# Altium schematic sheet driver4-8.SchDoc
size A4; SheetNumber: 4; SheetTotal: 4
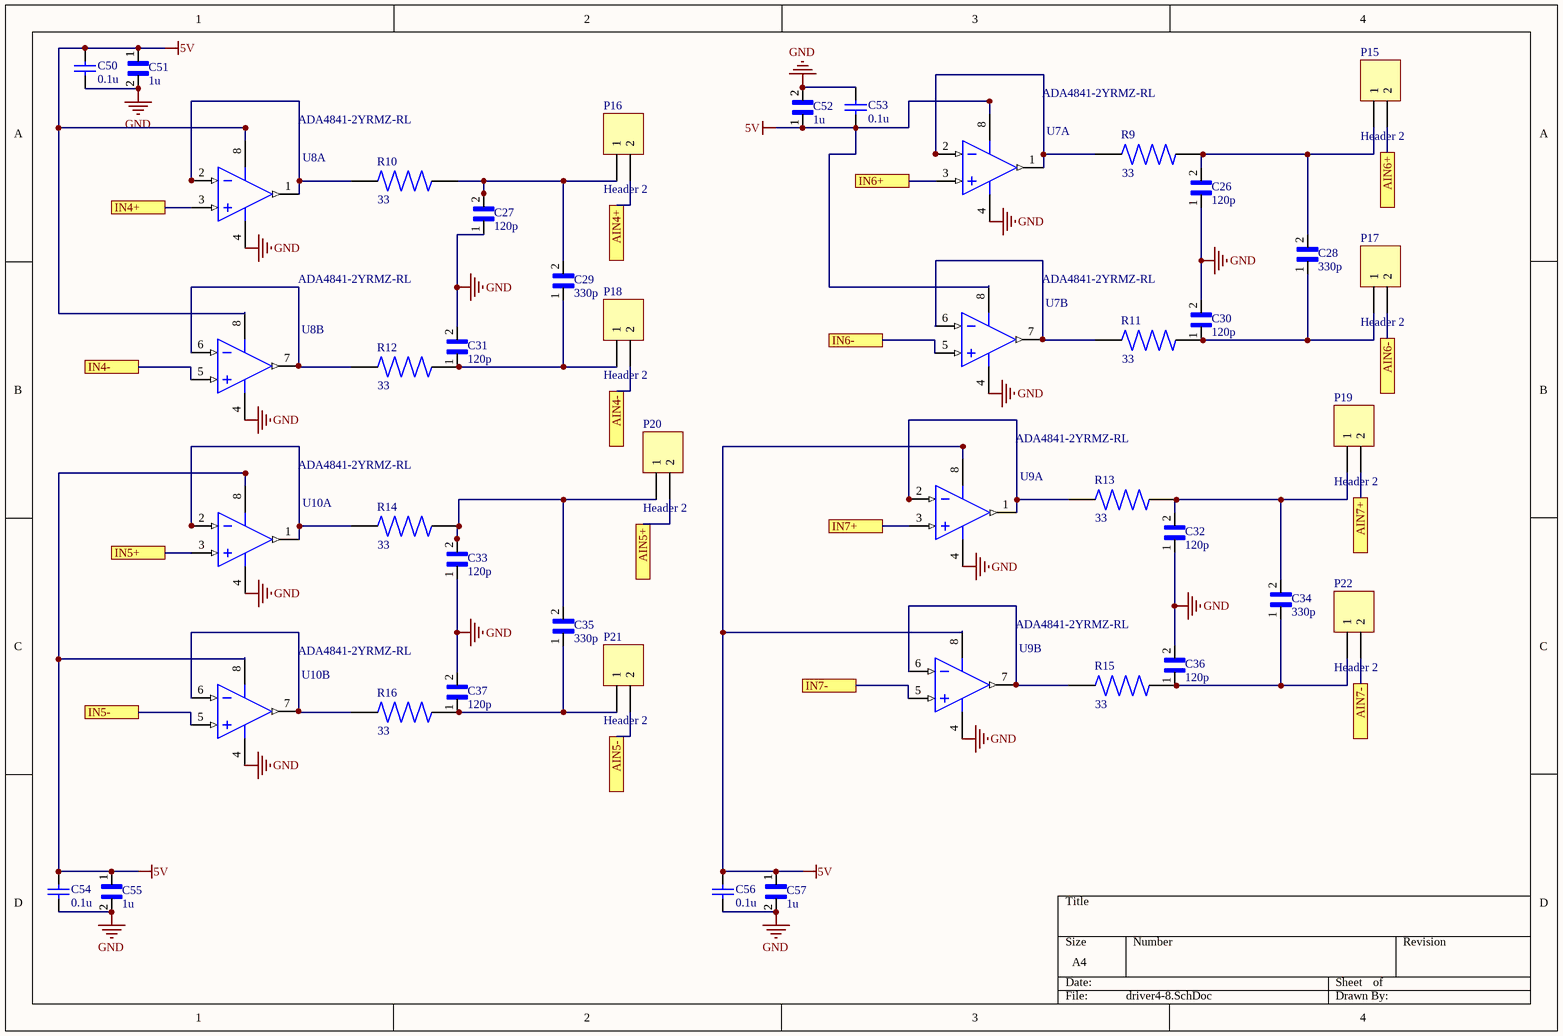
[diagram p0: driver4-8.SchDoc]

## Parts
C26  120p  [CAPC3216X94N]
C27  120p  [CAPC3216X94N]
C28  330p  [CAPC3216X94N]
C29  330p  [CAPC3216X94N]
C30  120p  [CAPC3216X94N]
C31  120p  [CAPC3216X94N]
C32  120p  [CAPC3216X94N]
C33  120p  [CAPC3216X94N]
C34  330p  [CAPC3216X94N]
C35  330p  [CAPC3216X94N]
C36  120p  [CAPC3216X94N]
C37  120p  [CAPC3216X94N]
C50  0.1u  [CAPC3216X94X50ML20T25]
C51  1u  [CAPC3216X127N]
C52  1u  [CAPC3216X127N]
C53  0.1u  [CAPC3216X94X50ML20T25]
C54  0.1u  [CAPC3216X94X50ML20T25]
C55  1u  [CAPC3216X127N]
C56  0.1u  [CAPC3216X94X50ML20T25]
C57  1u  [CAPC3216X127N]
P15  Header 2  [HDR1X2]
P16  Header 2  [HDR1X2]
P17  Header 2  [HDR1X2]
P18  Header 2  [HDR1X2]
P19  Header 2  [HDR1X2]
P20  Header 2  [HDR1X2]
P21  Header 2  [HDR1X2]
P22  Header 2  [HDR1X2]
R9  33  [RESC3116X75N]
R10  33  [RESC3116X75N]
R11  33  [RESC3116X75N]
R12  33  [RESC3116X75N]
R13  33  [RESC3116X75N]
R14  33  [RESC3116X75N]
R15  33  [RESC3116X75N]
R16  33  [RESC3116X75N]
U7  ADA4841-2YRMZ-RL  [ADI-RM-8_M]  (parts A,B of 2)
U8  ADA4841-2YRMZ-RL  [ADI-RM-8_M]  (parts A,B of 2)
U9  ADA4841-2YRMZ-RL  [ADI-RM-8_M]  (parts A,B of 2)
U10  ADA4841-2YRMZ-RL  [ADI-RM-8_M]  (parts A,B of 2)

## Ports
AIN4+, AIN4-, AIN5+, AIN5-, AIN6+, AIN6-, AIN7+, AIN7-, IN4+, IN4-, IN5+, IN5-, IN6+, IN6-, IN7+, IN7-

## Nets
5V: C50.1 C51.1 C52.1 C53.1 C54.1 C55.1 C56.1 C57.1 U7.8(+VS) U8.8(+VS) U9.8(+VS) U10.8(+VS)
GND: C26.1 C27.1 C30.2 C31.2 C32.1 C33.1 C36.2 C37.2 C50.2 C51.2 C52.2 C53.2 C54.2 C55.2 C56.2 C57.2 U7.4(-VS) U8.4(-VS) U9.4(-VS) U10.4(-VS)
AIN4+: P16.2 ; port AIN4+
AIN4-: P18.2 ; port AIN4-
AIN5+: P20.2 ; port AIN5+
AIN5-: P21.2 ; port AIN5-
AIN6+: P15.2 ; port AIN6+
AIN6-: P17.2 ; port AIN6-
AIN7+: P19.2 ; port AIN7+
AIN7-: P22.2 ; port AIN7-
IN4+: U8.3(+IN_1) ; port IN4+
IN4-: U8.5(+IN_2) ; port IN4-
IN5+: U10.3(+IN_1) ; port IN5+
IN5-: U10.5(+IN_2) ; port IN5-
IN6+: U7.3(+IN_1) ; port IN6+
IN6-: U7.5(+IN_2) ; port IN6-
IN7+: U9.3(+IN_1) ; port IN7+
IN7-: U9.5(+IN_2) ; port IN7-
NetC26_2: C26.2 C28.2 P15.1 R9.2
NetC27_2: C27.2 C29.2 P16.1 R10.2
NetC28_1: C28.1 C30.1 P17.1 R11.2
NetC29_1: C29.1 C31.1 P18.1 R12.2
NetC32_2: C32.2 C34.2 P19.1 R13.2
NetC33_2: C33.2 C35.2 P20.1 R14.2
NetC34_1: C34.1 C36.1 P22.1 R15.2
NetC35_1: C35.1 C37.1 P21.1 R16.2
NetR9_1: R9.1 U7.1(OUT_1) U7.2(-IN_1)
NetR10_1: R10.1 U8.1(OUT_1) U8.2(-IN_1)
NetR11_1: R11.1 U7.6(-IN_2) U7.7(OUT_2)
NetR12_1: R12.1 U8.6(-IN_2) U8.7(OUT_2)
NetR13_1: R13.1 U9.1(OUT_1) U9.2(-IN_1)
NetR14_1: R14.1 U10.1(OUT_1) U10.2(-IN_1)
NetR15_1: R15.1 U9.6(-IN_2) U9.7(OUT_2)
NetR16_1: R16.1 U10.6(-IN_2) U10.7(OUT_2)

## Library data of the parts
C26 C27 C30-C33 C36 C37 = 12061A121JAT2A: CERAMIC CAPACITOR 120PF 100V, C0G, 5%, 1206; MF: {'manufacturer': u'AVX'}; Value: *; Package: None; MP: 12061A121JAT2A; Price: None; Availability: Unavailable
C28 C29 C34 C35 = 12065A331JAT2A: Ceramic Multilayer Capacitor; Capacitor Type:General Purpose; Capacitance:330pF; Capacitance Tolerance:Â± 5%; Voltage Rating:50VDC; Capacitor Dielectric Type:Multilayer Ceramic; Package/Case:1206; Termination Type:SMD ;RoHS Compliant: Yes; MF: {'manufacturer': u'AVX'}; Value: *; Package: None; MP: 12065A331JAT2A; Price: None; Availability: Unavailable
C50 C53 C54 C56 = CMP-2000-05018-1: Chip Capacitor, Ceramic, 100 nF, 10%, 50 V, 1206, RoHS, Tape and Reel; Manufacturer: AVX; Rated Voltage: 50V; Dielectric: X7R; Capacitance: 100nF; Datasheet URL: http://www.mouser.com/ds/2/40/cauto-360.pdf; Manufacturer URL: http://www.avx.com/; Datasheet Version: Sep-14; Tolerance (%): ±10%; Case Size/Dimension: 1206
C51 C52 C55 C57 = 1206YC105KAT2A: Cap Ceramic 1uF 16V X7R 10% SMD 1206 125ÂÂŽ T/R; MF: {'manufacturer': u'AVX'}; Value: *; Package: None; MP: 1206YC105KAT2A; Price: None; Availability: Unavailable
P15-P22 = Header 2: Header, 2-Pin; LatestRevisionDate: 17-Jul-2002; LatestRevisionNote: Re-released for DXP Platform.; Publisher: Altium Limited
R9-R16 = RTAN1206BKE33R0: MF: {'manufacturer': u'Stackpole Electronics Inc'}; Value: *; Package: None; MP: RTAN1206BKE33R0; Price: None; Availability: Unavailable
U7-U10 = CMP-0384-01677-1: Double Channel Low Wide Band Noise Operational Amplifier, 80 MHz BW, 13 V/us SR, Industrial, 8-pin SOP (RM-8), Reel; Manufacturer: Analog Devices; Slew Rate: 13V/us; Iq/Amp: 1.5mA; Amplifiers Per Package: 2; Small Signal Bandwidth: 80MHz; V Span Min: 2.7V; V Span Max: 12V; Input Offset Voltage: 40uV; Input Bias Current: 3uA; ComponentLink3URL: http://www.analog.com/static/imported-files/packages/PKG_PDF/MSOP%28RM%29/RM_8.pdf; PartNumber: ADA4841-2YRMZ-RL; Mounting Technology: Surface Mount; DatasheetVersion: Rev. E; PackageDescription: 8-Pin Mini Small Outline Package, Body 3 x 3 mm, Pitch 0.65 mm; PackageReference: RM-8; ComponentLink2URL: http://www.analog.com/static/imported-files/data_sheets/ADA4841-1_4841-2.pdf; ComponentLink1Description: Manufacturer URL; ComponentLink2Description: Datasheet; Generic Part Number: ADA4841-2; ComponentLink1URL: http://www.analog.com/en/index.html; Code_JEDEC: MO-187-AA; ComponentLink3Description: Package Specification